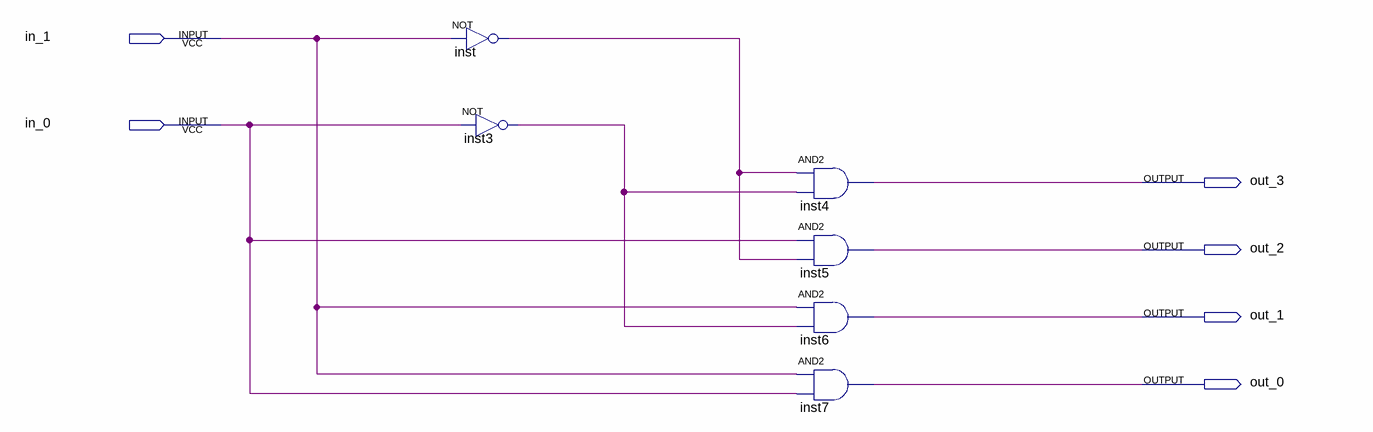
[diagram p0: schematic sheet]
// Quartus schematic dec2b.bdf as structural Verilog: 6 symbols, 6 pins
module dec2b (
  input  in_1,
  input  in_0,
  output out_3,
  output out_2,
  output out_1,
  output out_0
);

  wire inst3_out, inst_out;

  not inst (inst_out, in_1);
  not inst3 (inst3_out, in_0);
  and inst4 (out_3, inst_out, inst3_out);
  and inst5 (out_2, in_0, inst_out);
  and inst6 (out_1, in_1, inst3_out);
  and inst7 (out_0, in_1, in_0);
endmodule
